# EasyEDA schematic 1-Schematic_PedalBoard.json

## Sheets
1 Pedalboard: TITLE: Sheet_1; REV: 1.0; Date: 2020-06-14; Sheet: 1/1; Drawn By: kym.mcgain; Company: Your Company
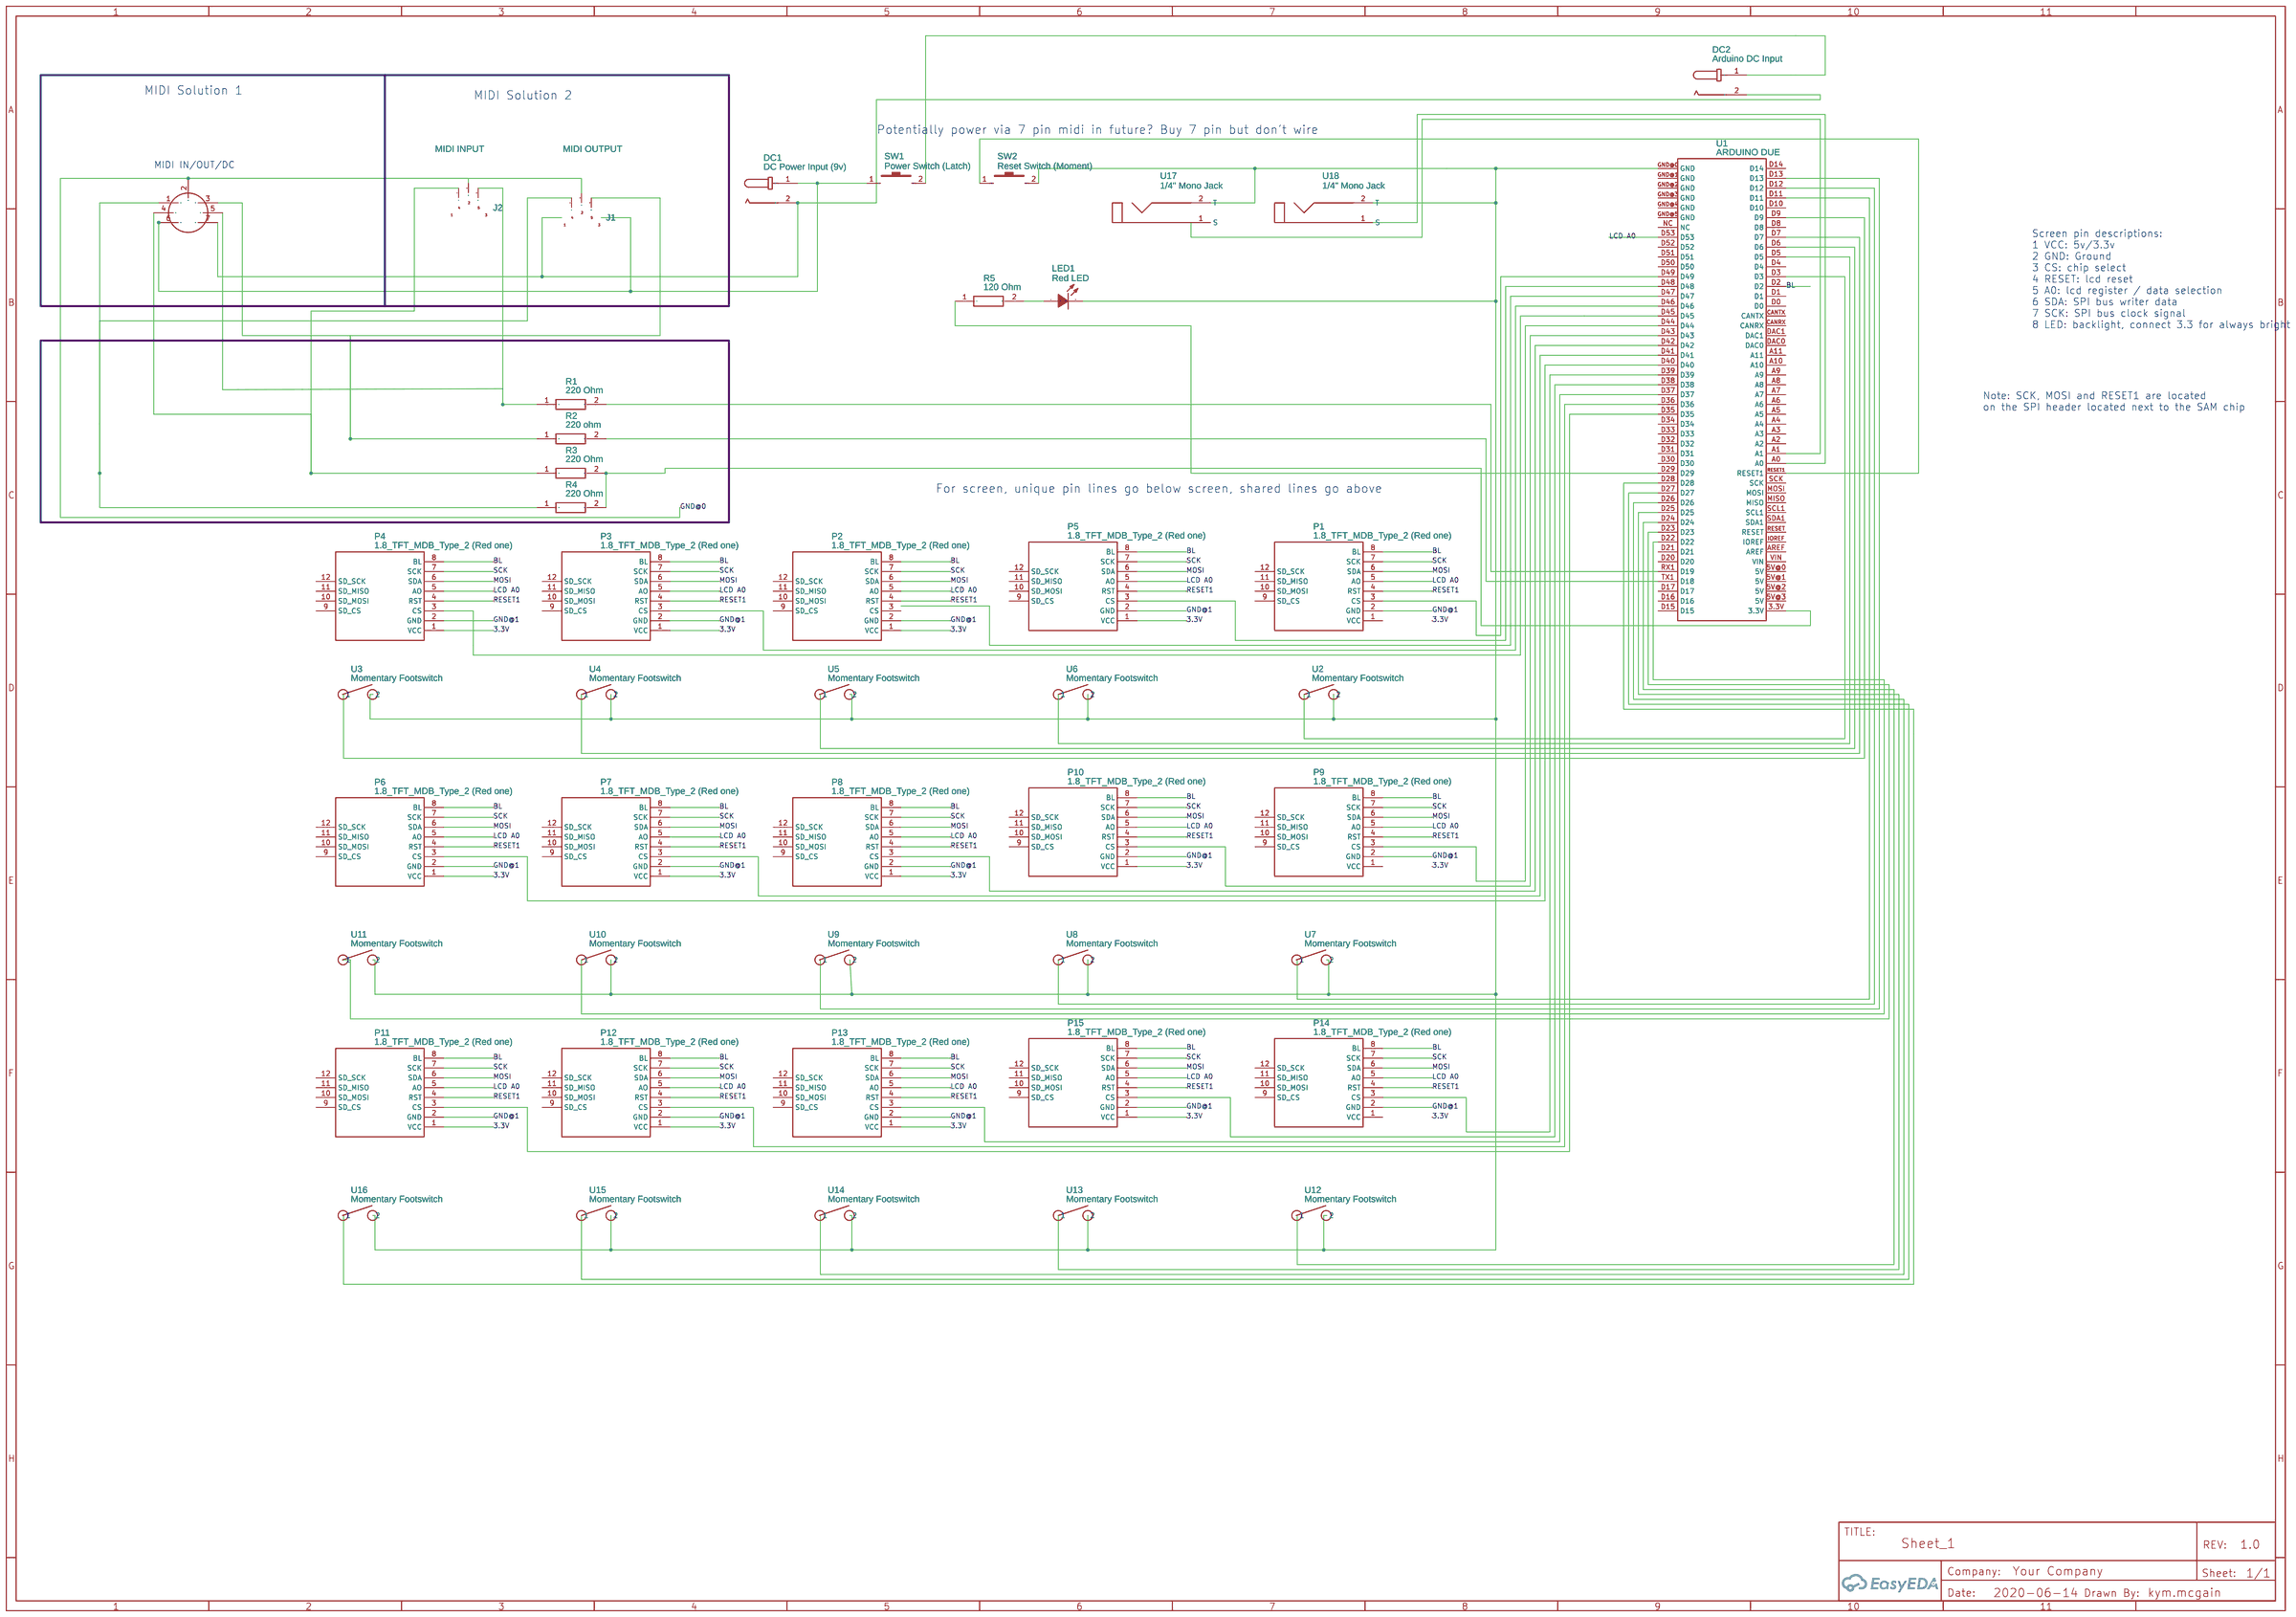
[diagram p0: Pedalboard]
2 MidiBox: TITLE: Sheet_2; Date: 2020-10-10; Drawn By: Kym McGain
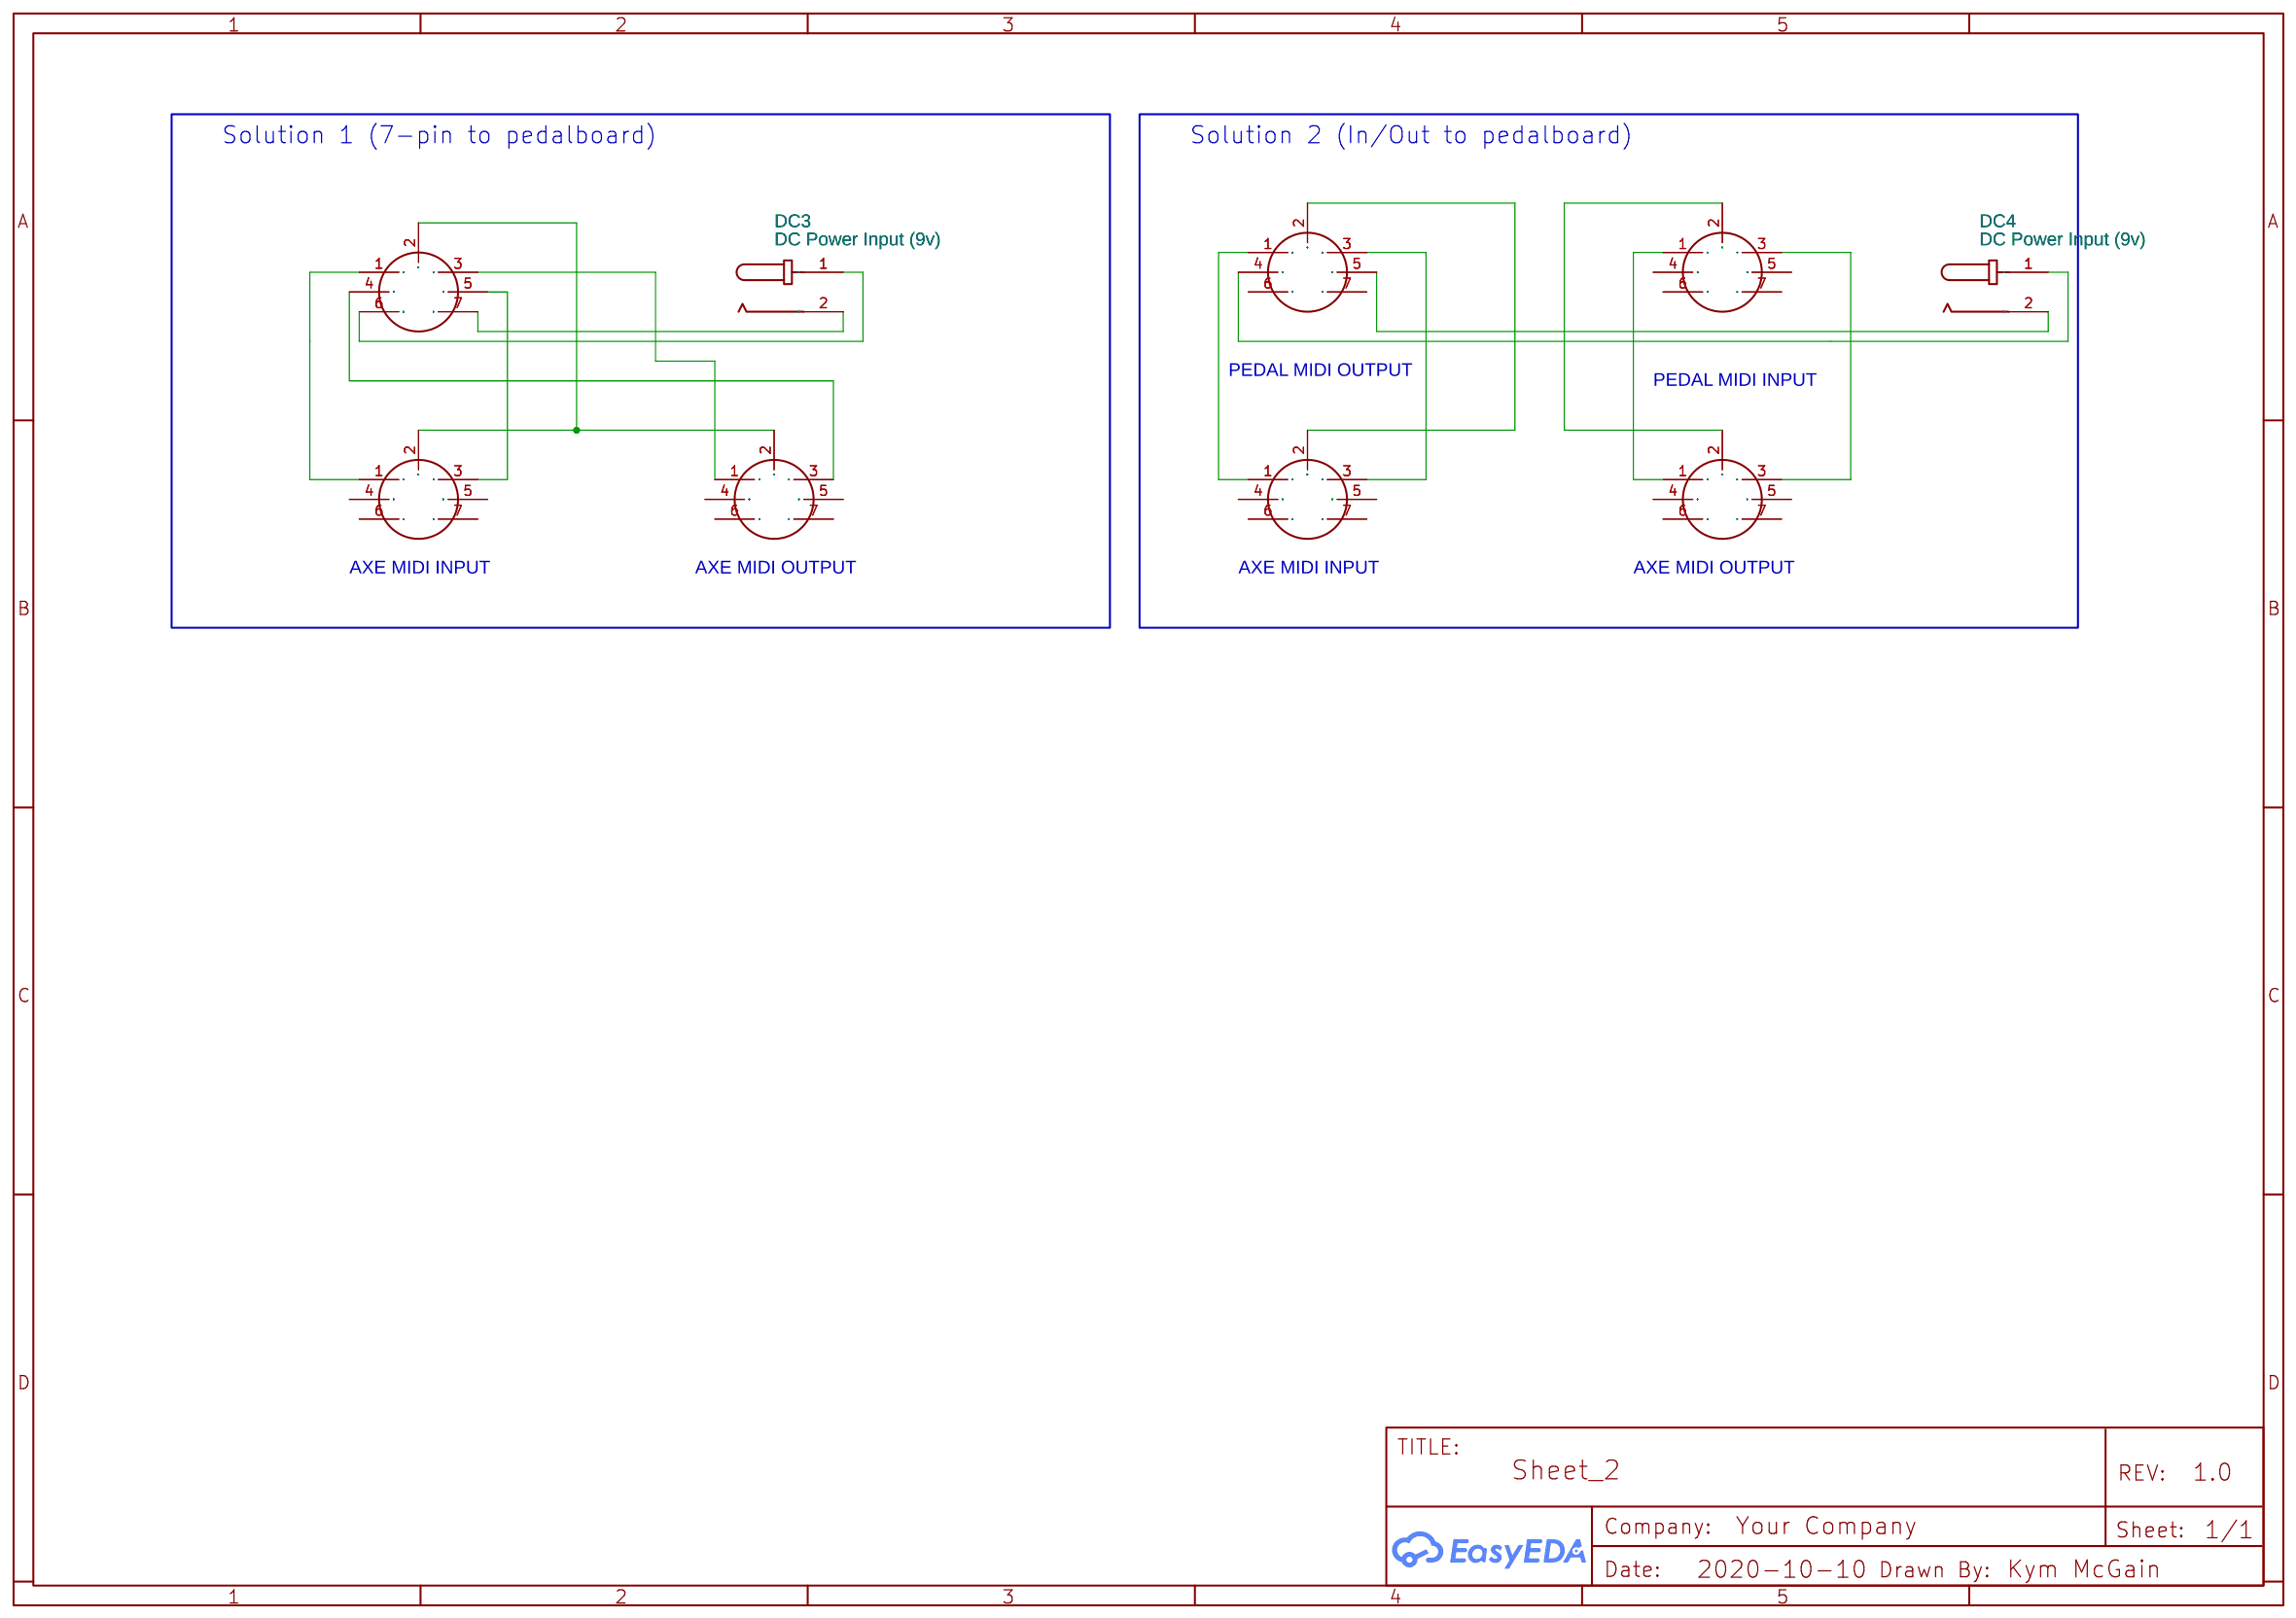
[diagram p1: MidiBox]

## Parts
sheet MidiBox
DC3  DC Power Input (9v)  [DC-IN-TH_DC-047B-13A]
DC4  DC Power Input (9v)  [DC-IN-TH_DC-047B-13A]
U20  DIN 45329
U21  DIN 45329
U22  DIN 45329
U23  DIN 45329
U24  DIN 45329
U25  DIN 45329
U26  DIN 45329
sheet Pedalboard
DC1  DC Power Input (9v)  [DC-IN-TH_DC-047B-13A]
DC2  Arduino DC Input  [DC-IN-TH_DC-047B-13A]
J1  MIDI OUTPUT  [3PADS]
J2  MIDI INPUT  [3PADS]
LED1  Red LED  [LED1206-R-RD]
P1  1.8_TFT_MDB_Type_2 (Red one)  [1.8_TFT]
P2  1.8_TFT_MDB_Type_2 (Red one)  [1.8_TFT]
P3  1.8_TFT_MDB_Type_2 (Red one)  [1.8_TFT]
P4  1.8_TFT_MDB_Type_2 (Red one)  [1.8_TFT]
P5  1.8_TFT_MDB_Type_2 (Red one)  [1.8_TFT]
P6  1.8_TFT_MDB_Type_2 (Red one)  [1.8_TFT]
P7  1.8_TFT_MDB_Type_2 (Red one)  [1.8_TFT]
P8  1.8_TFT_MDB_Type_2 (Red one)  [1.8_TFT]
P9  1.8_TFT_MDB_Type_2 (Red one)  [1.8_TFT]
P10  1.8_TFT_MDB_Type_2 (Red one)  [1.8_TFT]
P11  1.8_TFT_MDB_Type_2 (Red one)  [1.8_TFT]
P12  1.8_TFT_MDB_Type_2 (Red one)  [1.8_TFT]
P13  1.8_TFT_MDB_Type_2 (Red one)  [1.8_TFT]
P14  1.8_TFT_MDB_Type_2 (Red one)  [1.8_TFT]
P15  1.8_TFT_MDB_Type_2 (Red one)  [1.8_TFT]
R1  220 Ohm  [RESC6332X70N]
R2  220 ohm  [RESC6332X70N]
R3  220 Ohm  [RESC6332X70N]
R4  220 Ohm  [RESC6332X70N]
R5  120 Ohm  [RESC6332X70N]
SW1  Power Switch (Latch)  [KEY-3.0*4.0]
SW2  Reset Switch (Moment)  [KEY-3.0*4.0]
U1  ARDUINO DUE  [ARDUINO DUE]
U2  Momentary Footswitch  [MOMENTARY FOOTSWITCH]
U3  Momentary Footswitch  [MOMENTARY FOOTSWITCH]
U4  Momentary Footswitch  [MOMENTARY FOOTSWITCH]
U5  Momentary Footswitch  [MOMENTARY FOOTSWITCH]
U6  Momentary Footswitch  [MOMENTARY FOOTSWITCH]
U7  Momentary Footswitch  [MOMENTARY FOOTSWITCH]
U8  Momentary Footswitch  [MOMENTARY FOOTSWITCH]
U9  Momentary Footswitch  [MOMENTARY FOOTSWITCH]
U10  Momentary Footswitch  [MOMENTARY FOOTSWITCH]
U11  Momentary Footswitch  [MOMENTARY FOOTSWITCH]
U12  Momentary Footswitch  [MOMENTARY FOOTSWITCH]
U13  Momentary Footswitch  [MOMENTARY FOOTSWITCH]
U14  Momentary Footswitch  [MOMENTARY FOOTSWITCH]
U15  Momentary Footswitch  [MOMENTARY FOOTSWITCH]
U16  Momentary Footswitch  [MOMENTARY FOOTSWITCH]
U17  1/4" Mono Jack  [1/4" MONO JACK]
U18  1/4" Mono Jack  [1/4" MONO JACK]
U19  DIN 45329

## Library data of the parts
DC1-DC4 = DC-047B-13A: Supplier: LCSC; Manufacturer: HRO; Contributor: LCSC; Supplier Part: C145923
U19-U26 = DIN 45329: Contributor: kym.mcgain
J1 J2 = MIDI: Contributor: mfunky
LED1 = KT-1206Red LED: Supplier: LCSC; Manufacturer: KENTO; image: //image.lceda.cn/szlcsc/C49018.jpg; Supplier Part: C49018; LCSC Assembly: Yes; SMT Type: Extend
P1-P15 = 1.8_TFT_MDB_Type_2 (Red one): sourceId: 1T5FDZYC8; Supplier Part: undefined; Contributor: MikeDB
R1-R5 = 200 Ohms ±5% 1W Chip Resistor 2512 CRCW2512200RJNTG: Contributor: shaheen najeem
SW1 SW2 = Switch3x4x2: Supplier: LCSC; Manufacturer: ReliaPro; Supplier Part: C26638
U1 = ARDUINO DUE: Contributor: Louiss
U2-U16 = Momentary Footswitch: Contributor: Raphael Pelissier
U17 U18 = 1/4" Mono Jack: Manufacturer: REAN/Neutrik; Manufacturer Part: NYS2162-U; Supplier: Mouser; Supplier Part: 568-NYS2162-U; link: mouser.com/ProductDetail/REAN-Neutrik/NYS2162-U?qs=%252B86TLfaev286a5wVB8a3bw%3D%3D; Contributor: Teem1993

## Nets
3.3V: P2.1(VCC) P3.1(VCC) P4.1(VCC) P5.1(VCC) P6.1(VCC) P7.1(VCC) P8.1(VCC) P10.1(VCC) P11.1(VCC) P12.1(VCC) P13.1(VCC) P15.1(VCC)
GND@0: J1.R(2) J2.R(2) U19.2(6)
GND@1: P1.2(GND) P2.2(GND) P3.2(GND) P4.2(GND) P5.2(GND) P6.2(GND) P7.2(GND) P8.2(GND) P9.2(GND) P10.2(GND) P11.2(GND) P12.2(GND) P13.2(GND) P14.2(GND) P15.2(GND)
BL: P1.8(BL) P2.8(BL) P3.8(BL) P4.8(BL) P5.8(BL) P6.8(BL) P7.8(BL) P8.8(BL) P9.8(BL) P10.8(BL) P11.8(BL) P12.8(BL) P13.8(BL) P14.8(BL) P15.8(BL) U1.D2
LCD A0: P1.5(AO) P2.5(AO) P3.5(AO) P4.5(AO) P5.5(AO) P6.5(AO) P7.5(AO) P8.5(AO) P9.5(AO) P10.5(AO) P11.5(AO) P12.5(AO) P13.5(AO) P14.5(AO) P15.5(AO) U1.D53
MOSI: P1.6(SDA) P2.6(SDA) P3.6(SDA) P4.6(SDA) P5.6(SDA) P6.6(SDA) P7.6(SDA) P8.6(SDA) P9.6(SDA) P10.6(SDA) P11.6(SDA) P12.6(SDA) P13.6(SDA) P14.6(SDA) P15.6(SDA)
RESET1: P1.4(RST) P2.4(RST) P3.4(RST) P4.4(RST) P5.4(RST) P6.4(RST) P7.4(RST) P8.4(RST) P9.4(RST) P10.4(RST) P11.4(RST) P12.4(RST) P13.4(RST) P14.4(RST) P15.4(RST)
SCK: P1.7(SCK) P2.7(SCK) P3.7(SCK) P4.7(SCK) P5.7(SCK) P6.7(SCK) P7.7(SCK) P8.7(SCK) P9.7(SCK) P10.7(SCK) P11.7(SCK) P12.7(SCK) P13.7(SCK) P14.7(SCK) P15.7(SCK)
Net-(DC1-1): DC1.1 SW1.1 U19.6
Net-(DC1-2): DC1.2 DC2.2 U19.7(6)
Net-(DC2-1): DC2.1 SW1.2
Net-(DC3-1): DC3.1 U20.6
Net-(DC3-2): DC3.2 U20.7(6)
Net-(DC4-1): DC4.1 U25.4(6)
Net-(DC4-2): DC4.2 U25.5(6)
Net-(J1-S): J1.S(5) R2.1 U19.3(6)
Net-(J1-T): J1.T(4) R4.1 U19.1(6)
Net-(J2-S): J2.S(5) R1.1 U19.5(6)
Net-(J2-T): J2.T(4) R3.1 U19.4(6)
Net-(LED1-1): LED1.1(A) R5.2
Net-(LED1-2): LED1.2(K) SW2.2 U1.GND@0(GND) U2.2 U3.2 U4.2 U5.2 U6.2 U7.2 U8.2 U9.2 U10.2 U11.2 U12.2 U13.2 U14.2 U15.2 U16.2 U17.2(T) U18.2(T)
Net-(P1-3): P1.3(CS) U1.D49
Net-(P3-3): P3.3(CS) U1.D46
Net-(P4-3): P4.3(CS) U1.D45
Net-(P5-3): P5.3(CS) U1.D48
Net-(P6-3): P6.3(CS) U1.D40
Net-(P7-3): P7.3(CS) U1.D41
Net-(P8-3): P8.3(CS) U1.D42
Net-(P9-3): P9.3(CS) U1.D44
Net-(P10-3): P10.3(CS) U1.D43
Net-(P11-3): P11.3(CS) U1.D35
Net-(P12-3): P12.3(CS) U1.D36
Net-(P13-3): P13.3(CS) U1.D37
Net-(P14-3): P14.3(CS) U1.D39
Net-(P15-3): P15.3(CS) U1.D38
Net-(R1-2): R1.2 U1.RX1(D19)
Net-(R2-2): R2.2 U1.TX1(D18)
Net-(R3-2): R3.2 R4.2 U1.3.3V
Net-(R5-1): R5.1 U1.D29
Net-(SW2-1): SW2.1 U1.RESET1
Net-(U1-A0): U1.A0 U18.1(S)
Net-(U1-A1): U1.A1 U17.1(S)
Net-(U1-D3): U1.D3 U2.1
Net-(U1-D5): U1.D5 U6.1
Net-(U1-D6): U1.D6 U5.1
Net-(U1-D7): U1.D7 U4.1
Net-(U1-D9): U1.D9 U3.1
Net-(U1-D11): U1.D11 U7.1
Net-(U1-D12): U1.D12 U8.1
Net-(U1-D13): U1.D13 U9.1
Net-(U1-D22): U1.D22 U10.1
Net-(U1-D23): U1.D23 U11.1
Net-(U1-D24): U1.D24 U12.1
Net-(U1-D25): U1.D25 U13.1
Net-(U1-D26): U1.D26 U14.1
Net-(U1-D27): U1.D27 U15.1
Net-(U1-D28): U1.D28 U16.1
Net-(U20-1): U20.1(6) U22.1(6)
Net-(U20-2): U20.2(6) U21.2(6) U22.2(6)
Net-(U20-3): U20.3(6) U21.1(6)
Net-(U20-4): U20.4(6) U21.3(6)
Net-(U20-5): U20.5(6) U22.3(6)
Net-(U23-1): U23.1(6) U26.1(6)
Net-(U23-2): U23.2(6) U26.2(6)
Net-(U23-3): U23.3(6) U26.3(6)
Net-(U24-1): U24.1(6) U25.1(6)
Net-(U24-2): U24.2(6) U25.2(6)
Net-(U24-3): U24.3(6) U25.3(6)

Not connected (* = marked no-connect by the designer): P1 1(VCC) 9(SD_CS) 10(SD_MOSI) 11(SD_MISO) 12(SD_SCK); P2 3(CS) 9(SD_CS) 10(SD_MOSI) 11(SD_MISO) 12(SD_SCK); P3 9(SD_CS) 10(SD_MOSI) 11(SD_MISO) 12(SD_SCK); P4 9(SD_CS) 10(SD_MOSI) 11(SD_MISO) 12(SD_SCK); P5 9(SD_CS) 10(SD_MOSI) 11(SD_MISO) 12(SD_SCK); P6 9(SD_CS) 10(SD_MOSI) 11(SD_MISO) 12(SD_SCK); P7 9(SD_CS) 10(SD_MOSI) 11(SD_MISO) 12(SD_SCK); P8 9(SD_CS) 10(SD_MOSI) 11(SD_MISO) 12(SD_SCK); P9 1(VCC) 9(SD_CS) 10(SD_MOSI) 11(SD_MISO) 12(SD_SCK); P10 9(SD_CS) 10(SD_MOSI) 11(SD_MISO) 12(SD_SCK); P11 9(SD_CS) 10(SD_MOSI) 11(SD_MISO) 12(SD_SCK); P12 9(SD_CS) 10(SD_MOSI) 11(SD_MISO) 12(SD_SCK); P13 9(SD_CS) 10(SD_MOSI) 11(SD_MISO) 12(SD_SCK); P14 1(VCC) 9(SD_CS) 10(SD_MOSI) 11(SD_MISO) 12(SD_SCK); P15 9(SD_CS) 10(SD_MOSI) 11(SD_MISO) 12(SD_SCK); U1 5V@0(5V) 5V@1(5V) 5V@2(5V) 5V@3(5V) A2 A3 A4 A5 A6 A7 A8 A9 A10 A11 AREF CANRX CANTX D0 D1 D4 D8 D10 D14 D15 D16 D17 D20 D21 D30 D31 D32 D33 D34 D47 D50 D51 D52 DAC0 DAC1 GND@1(GND) GND@2(GND) GND@3(GND) GND@4(GND) GND@5(GND) IOREF MISO MOSI NC RESET SCK SCL1 SDA1 VIN; U21 4(6) 5(6) 6 7(6); U22 4(6) 5(6) 6 7(6); U23 4(6) 5(6) 6 7(6); U24 4(6) 5(6) 6 7(6); U25 6 7(6); U26 4(6) 5(6) 6 7(6)

## Notes on the sheets
sheet 1
- MIDI Solution 1
- MIDI Solution 2
- Potentially power via 7 pin midi in future? Buy 7 pin but don't wire
- MIDI IN/OUT/DC
- Screen pin descriptions:
  1 VCC: 5v/3.3v
  2 GND: Ground
  3 CS: chip select
  4 RESET: lcd reset
  5 A0: lcd register / data selection
  6 SDA: SPI bus writer data
  7 SCK: SPI bus clock signal
  8 LED: backlight, connect 3.3 for always bright
- Note: SCK, MOSI and RESET1 are located
  on the SPI header located next to the SAM chip
- For screen, unique pin lines go below screen, shared lines go above
sheet 2
- Solution 1 (7-pin to pedalboard)
- Solution 2 (In/Out to pedalboard)
- PEDAL MIDI OUTPUT
- PEDAL MIDI INPUT
- AXE MIDI INPUT
- AXE MIDI OUTPUT
- AXE MIDI INPUT
- AXE MIDI OUTPUT
